# Altium schematic sheet USB.SchDoc
size A
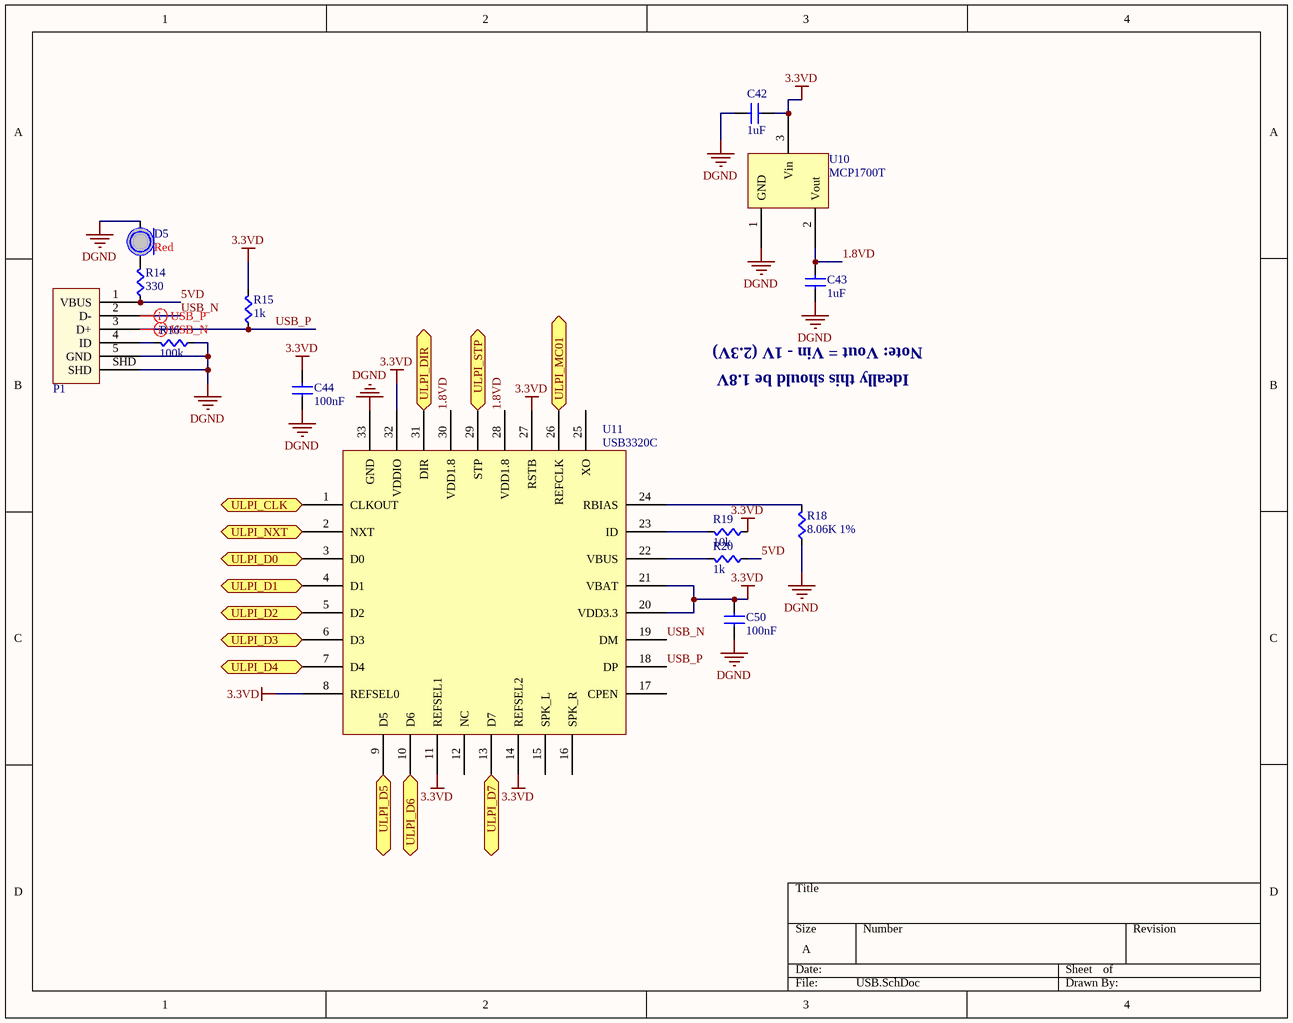
[diagram p0: USB.SchDoc]

## Parts
C42  value 1uF  [CAPC0603]  (hidden comment: Cap)
C43  value 1uF  [CAPC0603]  (hidden comment: Cap)
C44  value 100nF  [CAPC0603]  (hidden comment: Cap)
C50  value 100nF  [CAPC0603]  (hidden comment: Cap)
D5  Color: Red  [LED0805]  (hidden comment: LED)
P1  USB Micro  [10118192-0001LF]  (value not drawn)
R14  value 330  [RES0603]  (hidden comment: Res)
R15  value 1k  [RES0603]  (hidden comment: Res)
R16  value 100k  [RES0603]  (hidden comment: Res)
R18  value 8.06K 1%  [RES0603]  (hidden comment: Res)
R19  value 10k  [RES0603]  (hidden comment: Res)
R20  value 1k  [RES0603]  (hidden comment: Res)
U10  MCP1700T  [SOT23-3]
U11  USB3320C  [QFN-32]

## Ports
ULPI_CLK (bidir), ULPI_D0 (bidir), ULPI_D1 (bidir), ULPI_D2 (bidir), ULPI_D3 (bidir), ULPI_D4 (bidir), ULPI_D5 (bidir), ULPI_D6 (bidir), ULPI_D7 (bidir), ULPI_DIR (bidir), ULPI_MC01 (bidir), ULPI_NXT (bidir), ULPI_STP (bidir)

## Nets
3.3VD: C42.1(A) C44.1(A) C50.1(A) R15.1(A) R19.2(B) U10.3(Vin) U11.8(REFSEL0) U11.11(REFSEL1) U11.14(REFSEL2) U11.20(VDD3.3) U11.21(VBAT) U11.27(RSTB) U11.32(VDDIO)
DGND: C42.2(B) C43.2(B) C44.2(B) C50.2(B) D5.C P1.5(GND) P1.SHD R16.2(B) R18.2(B) U10.1(GND) U11.33(GND)
1.8VD: C43.1(A) U10.2(Vout) U11.28(VDD1.8) U11.30(VDD1.8)
5VD: P1.1(VBUS) R14.2(B) R20.2(B)
ULPI_CLK: U11.1(CLKOUT) ; port ULPI_CLK
ULPI_D0: U11.3(D0) ; port ULPI_D0
ULPI_D1: U11.4(D1) ; port ULPI_D1
ULPI_D2: U11.5(D2) ; port ULPI_D2
ULPI_D3: U11.6(D3) ; port ULPI_D3
ULPI_D4: U11.7(D4) ; port ULPI_D4
ULPI_D5: U11.9(D5) ; port ULPI_D5
ULPI_D6: U11.10(D6) ; port ULPI_D6
ULPI_D7: U11.13(D7) ; port ULPI_D7
ULPI_DIR: U11.31(DIR) ; port ULPI_DIR
ULPI_MC01: U11.26(REFCLK) ; port ULPI_MC01
ULPI_NXT: U11.2(NXT) ; port ULPI_NXT
ULPI_STP: U11.29(STP) ; port ULPI_STP
USB_N: P1.2(D-) U11.19(DM)
USB_P: P1.3(D+) R15.2(B) U11.18(DP)
NetD5_A: D5.A R14.1(A)
NetP1_4: P1.4(ID) R16.1(A)
NetR18_1: R18.1(A) U11.24(RBIAS)
NetR19_1: R19.1(A) U11.23(ID)
NetR20_1: R20.1(A) U11.22(VBUS)

Not connected (* = marked no-connect by the designer): U11 12(NC) 15(SPK_L) 16(SPK_R) 17(CPEN) 25(XO)

## Layout directives
differential pair: USB_N, USB_P

## Notes on the sheet
- Ideally this should be 1.8V
- Note: Vout = Vin - 1V (2.3V)

## Library data of the parts
P1 = USB Micro: USB Mini B Metal Shield SMT; Supplier 1: Digi-Key; Supplier Part Number 1: 609-4613-1-ND
U10 = LDO 1.8V: IC REG LDO 1.8V 0.2A SOT23-3; Supplier 1: Digi-Key; Supplier Part Number 1: MCP1700T1802ETTCT-ND
U11 = USB3320C: MULTI-FREQ USB 2.0 ULPI PHY; Supplier Part Number 1: USB3320C-EZK-ND; Supplier 1: Digi-Key
C42-C44 C50 = Cap: Supplier 1: Digi-Key; Supplier Part Number 1: 1276-1000-1-ND
D5 = LED: Supplier 1: Digi-Key; Supplier Part Number 1: 754-1122-1-ND
R14-R16 R18-R20 = Res: Supplier 1: Digi-Key; Supplier Part Number 1: RMCF0603JT10K0CT-ND